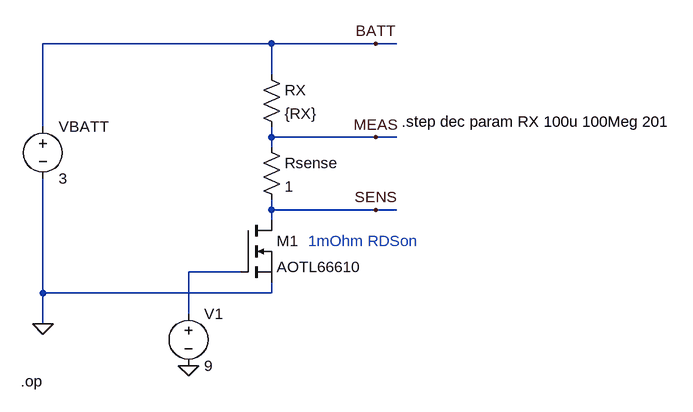
[diagram p0: schematic Ohmmeter.asc]
Ohmmeter.asc, the LTspice schematic file:
Version 4
SHEET 1 880 680
WIRE 128 0 -224 0
WIRE 288 0 128 0
WIRE 320 0 288 0
WIRE 128 48 128 0
WIRE -224 128 -224 0
WIRE 128 144 128 128
WIRE 288 144 128 144
WIRE 320 144 288 144
WIRE 128 160 128 144
WIRE 128 256 128 240
WIRE 288 256 128 256
WIRE 320 256 288 256
WIRE 128 272 128 256
WIRE 80 352 0 352
WIRE -224 384 -224 208
WIRE 128 384 128 368
WIRE 128 384 -224 384
WIRE 0 416 0 352
WIRE -224 432 -224 384
FLAG -224 432 0
FLAG 0 496 0
FLAG 288 0 BATT
FLAG 288 144 MEAS
FLAG 288 256 SENS
SYMBOL res 112 32 R0
SYMATTR InstName RX
SYMATTR Value {RX}
SYMBOL voltage -224 112 R0
SYMATTR InstName VBATT
SYMATTR Value 3
SYMBOL nmos 80 272 R0
SYMATTR InstName M1
SYMATTR Value AOTL66610
SYMBOL res 112 144 R0
SYMATTR InstName Rsense
SYMATTR Value 1
SYMBOL voltage 0 400 R0
SYMATTR InstName V1
SYMATTR Value 9
TEXT 328 120 Left 2 !.step dec param RX 100u 100Meg 201
TEXT 184 304 Left 2 ;1mOhm RDSon
TEXT -258 520 Left 2 !.op

The netlist it stands for:
* Ohmmeter.asc
RX BATT MEAS {RX}
VBATT BATT 0 3
M1 SENS N001 0 0 AOTL66610
Rsense MEAS SENS 1
V1 N001 0 9
.model NMOS NMOS
.model PMOS PMOS
.lib standard.mos
.step dec param RX 100u 100Meg 201
* 1mOhm RDSon
.op
.backanno
.end